# EAGLE design untitled (EAGLE 7.5.0)
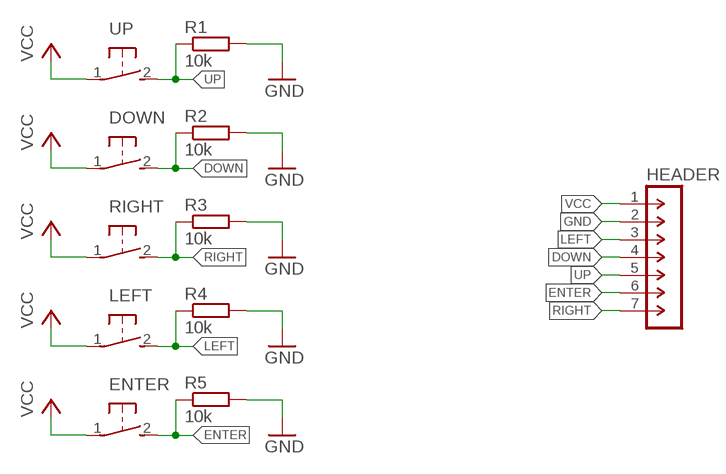
[diagram p0: schematic, sheet 1]

## Parts
DOWN  DTSM-3  [DTSM-3]
ENTER  DTSM-3  [DTSM-3]
HEADER  M-1X07-SIP-100-32Y  [SIP-100-07-32Y]
LEFT  DTSM-3  [DTSM-3]
R1  10k  R-EU_R1206  [R1206]
R2  10k  R-EU_R1206  [R1206]
R3  10k  R-EU_R1206  [R1206]
R4  10k  R-EU_R1206  [R1206]
R5  10k  R-EU_R1206  [R1206]
RIGHT  DTSM-3  [DTSM-3]
UP  DTSM-3  [DTSM-3]

## Nets
DOWN: DOWN.2 HEADER.4 R2.1
ENTER: ENTER.2 HEADER.6 R5.1
GND: HEADER.2 R1.2 R2.2 R3.2 R4.2 R5.2
LEFT: HEADER.3 LEFT.2 R4.1
RIGHT: HEADER.7 R3.1 RIGHT.2
UP: HEADER.5 R1.1 UP.2
VCC: DOWN.1 ENTER.1 HEADER.1 LEFT.1 RIGHT.1 UP.1

## Library data of the parts
DOWN ENTER LEFT RIGHT UP = switch-tact:DTSM-3
HEADER = con-headers-jp:M-1X07-: MALE HEADER
R1-R5 = resistor:R-EU_: RESISTOR, European symbol

## Board
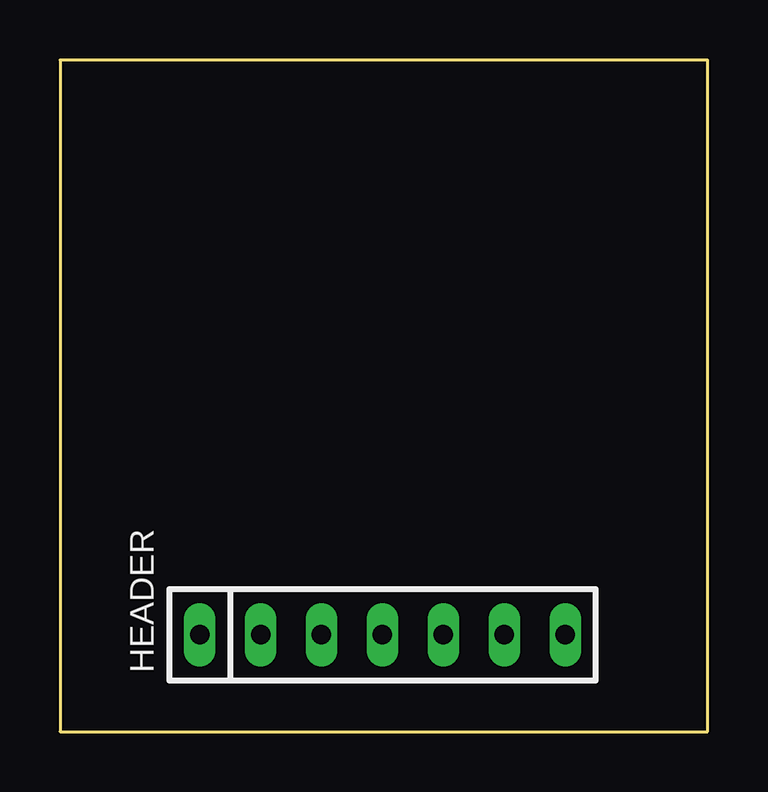
[diagram p1: board, top side]
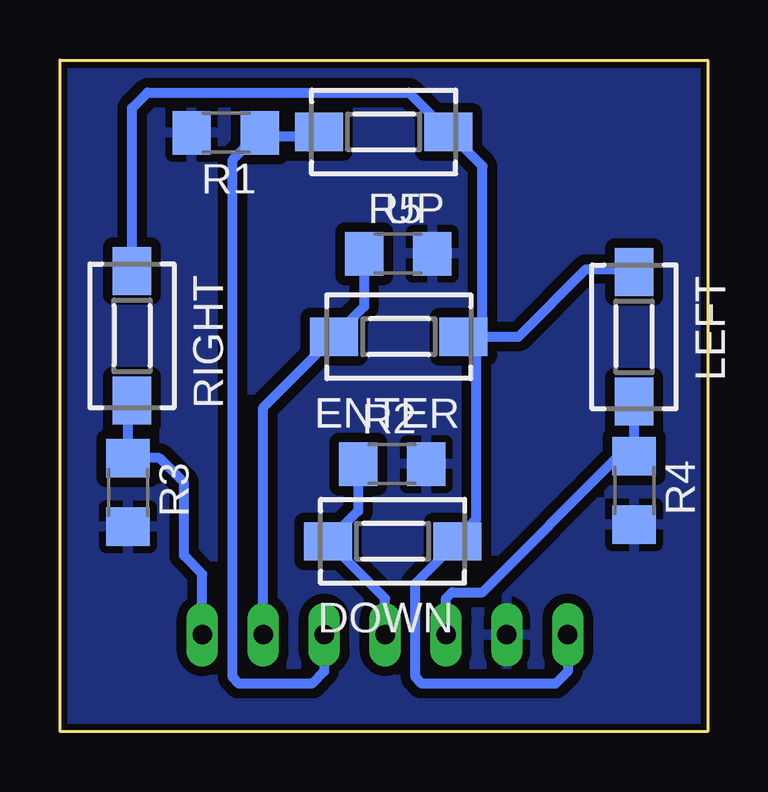
[diagram p2: board, bottom side, seen from below]

Size 27 x 28 mm. Coordinates in mm from the lower left corner, seen from the top.
Outline: 0,0 27,0 27,28 0,28 0,0
Copper layers (1*16): Top 0.035mm / dielectric 1.5mm / Bottom 0.035mm
Design rules "default 16mils": minimum track width 10mil, minimum drill 24mil, track to track 16mil, track to pad 16mil, pad to pad 16mil, via to via 16mil, smd to smd 10mil, copper to edge 10mil, drill to drill 10mil, minimum pad ring 10mil, minimum via ring 8mil, stop-mask expansion 4mil, vias tented up to drill 0mil, thermal gap 12mil

### Footprints (pad centres in the part's own frame; a part is rotated, then mirrored left to right if it is on the bottom)
DTSM-3 = smd 2 x 1.6: 1 -2.7,0; 2 2.7,0
SIP-100-07-32Y = drill 0.813 long: 1 -7.62,0; 2 -5.08,0; 3 -2.54,0; 4 0,0; 5 2.54,0; 6 5.08,0; 7 7.62,0
R1206 = smd 1.6 x 1.803: 1 -1.422,0; 2 1.422,0

### Placement (x,y rotation side)
DOWN  13.13,7.93 180 bottom
ENTER  12.87,16.46 180 bottom
HEADER  13.45,4.03 0 top
LEFT  3.06,16.46 270 bottom
R1  20.09,24.96 180 bottom
R2  13.14,11.15 0 bottom
R3  24.16,9.97 270 bottom
R4  3.06,10.05 270 bottom
R5  12.9,19.92 0 bottom
RIGHT  24,16.49 270 bottom
UP  13.51,24.99 180 bottom

### Tracks (layer width: path | path; a pad name or v marks a point on that pad's centre or on a via)
DOWN
  Bottom 0.406: HEADER.4 13.45,5.54 DOWN.2 14.57,9.19 R2.1
ENTER
  Bottom 0.406: R5.1 14.32,17.71 ENTER.2 18.53,13.51 HEADER.6
GND
  pour Bottom: 0,0 27,0 27,28 0,28
LEFT
  Bottom 0.406: HEADER.3 10.91,5.56 10.65,5.81 9.38,5.81 3.79,11.4 3.13,11.4 R4.1 LEFT.2 3.03,13.72
RIGHT
  Bottom 0.406: 24.11,13.68 RIGHT.2 24.16,13.63 R3.1 22.84,11.4 21.83,10.38 21.83,7.33 21.07,6.57 HEADER.7
UP
  Bottom 0.406: 16.24,24.96 UP.2 16.38,24.82 18.53,24.82 R1.1 19.8,23.83 19.8,2.25 19.54,2 16.49,2 15.99,2.51 HEADER.5
VCC
  Bottom 0.406: HEADER.1 5.83,2.51 6.33,2 11.92,2 12.18,2.25 12.18,6.18 DOWN.1 10.43,8.06 9.64,8.86 9.64,15.93 ENTER.1 | ENTER.1 7.88,16.46 5.06,19.27 3.18,19.27 LEFT.1 | ENTER.1 9.91,16.46 9.38,16.99 9.38,23.57 UP.1 12.45,26.64 23.35,26.64 24,25.99 RIGHT.1